# EAGLE schematic gemini (EAGLE 7.5.0)
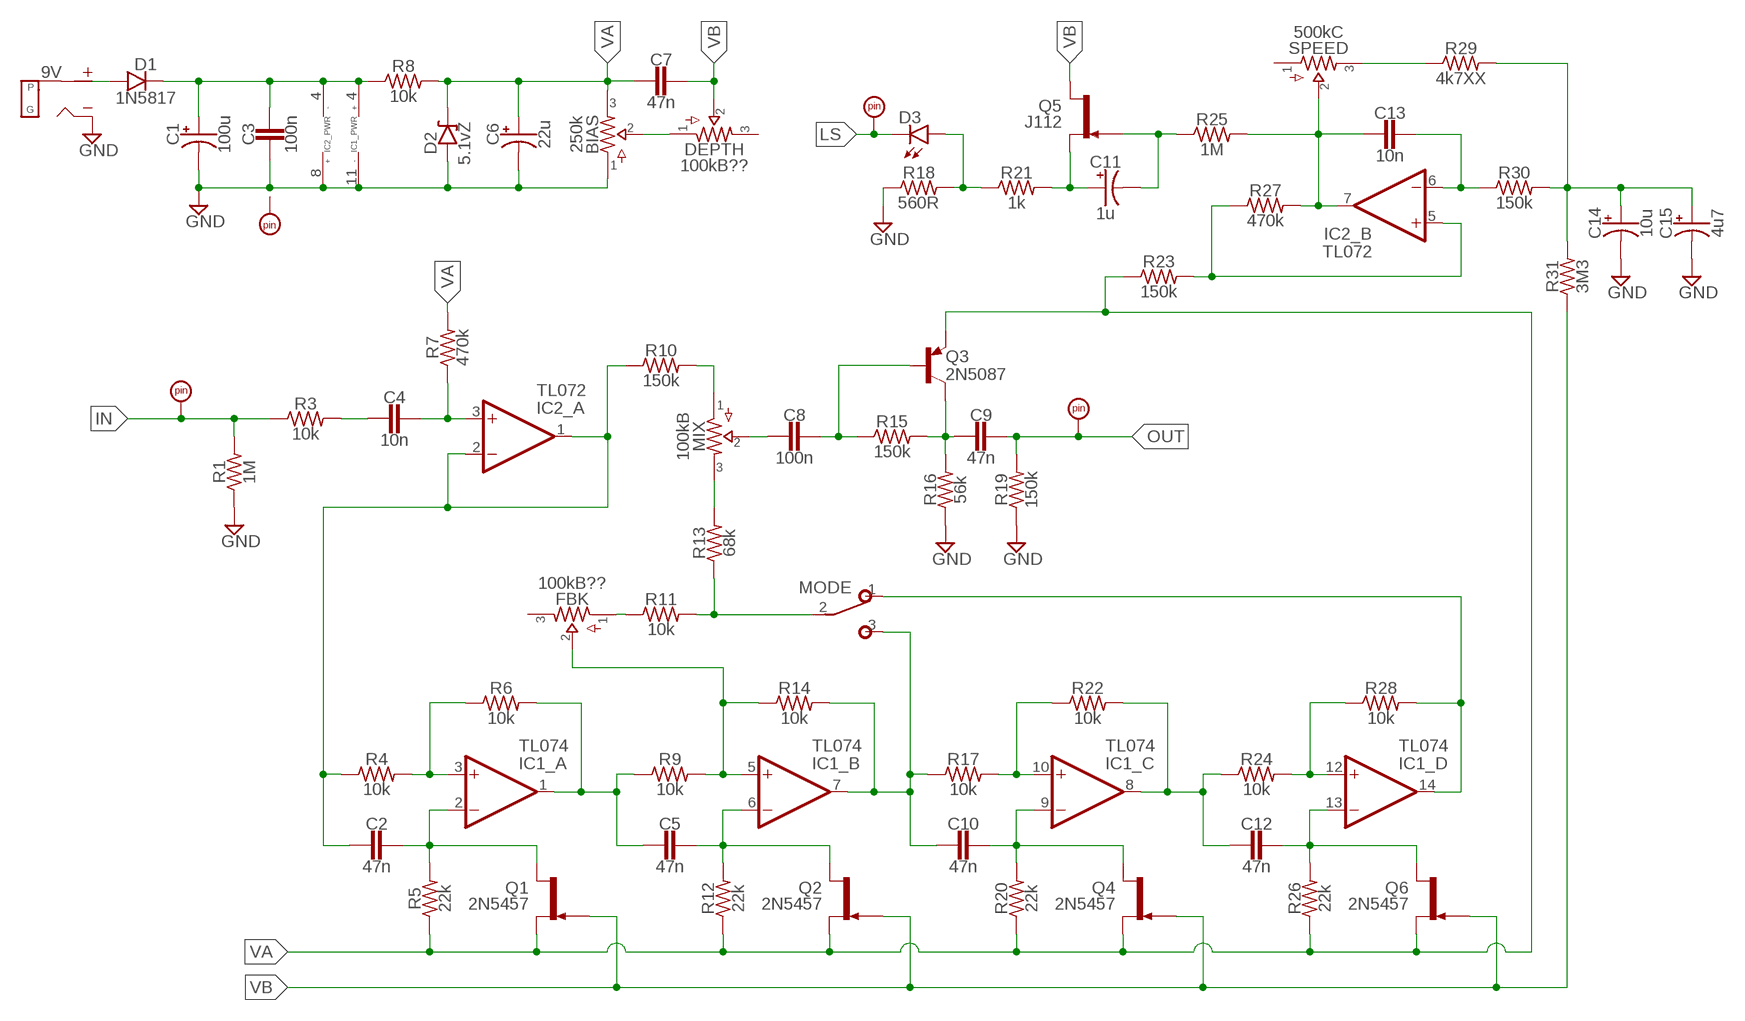
[diagram p0: schematic, sheet 1]

## Parts
9V  DC_MONO  [DC]
BIAS  250k  POTSTRIM  [2262_TRIM]
C1  100u  0501  [050_020_1]
C2  47n  CER/FILM2  [050X030_025_2]
C3  100n  CER/FILM2  [050X030_025_2]
C4  10n  CER/FILM2  [050X030_025_2]
C5  47n  CER/FILM2  [050X030_025_2]
C6  22u  0501  [050_020_1]
C7  47n  CER/FILM2  [050X030_025_2]
C8  100n  CER/FILM2  [050X030_025_2]
C9  47n  CER/FILM2  [050X030_025_2]
C10  47n  CER/FILM2  [050X030_025_2]
C11  1u  0501  [050_020_1]
C12  47n  CER/FILM2  [050X030_025_2]
C13  10n  CER/FILM2  [050X030_025_2]
C14  10u  0501  [050_020_1]
C15  4u7  0501  [050_020_1]
D1  1N5817  DO41.2  [DO41-2]
D2  5.1vZ  ZENER.3  [DO41-3]
D3  LEDA  [3MM_A]
DEPTH  100kB??  POTS16MM  [16MM]
FBK  100kB??  POTS16MM  [16MM]
GND  PADRND  [ROUND]
IC1  TL074  QUADTH  [DIL14]
IC2  TL072  DUALTH  [DIL08]
IN  PADSQR  [SQUARE]
MIX  100kB  POTS16MM  [16MM]
MODE  SPDTPADS  [SPDT]
OUT  PADSQR  [SQUARE]
PAD3  PADRND  [ROUND]
Q1  2N5457  [TO92-]
Q2  2N5457  [TO92-]
Q3  2N5087  2N5087.1  [TO92-]
Q4  2N5457  [TO92-]
Q5  J112  J201  [TO92-]
Q6  2N5457  [TO92-]
R1  1M  R_.3B  [R0207/3]
R3  10k  R_.3B  [R0207/3]
R4  10k  R_.3B  [R0207/3]
R5  22k  R_.3B  [R0207/3]
R6  10k  R_.3B  [R0207/3]
R7  470k  R_.3B  [R0207/3]
R8  10k  R_.3B  [R0207/3]
R9  10k  R_.3B  [R0207/3]
R10  150k  R_.3B  [R0207/3]
R11  10k  R_.3B  [R0207/3]
R12  22k  R_.3B  [R0207/3]
R13  68k  R_.3B  [R0207/3]
R14  10k  R_.3B  [R0207/3]
R15  150k  R_.3B  [R0207/3]
R16  56k  R_.3B  [R0207/3]
R17  10k  R_.3B  [R0207/3]
R18  560R  R_.3B  [R0207/3]
R19  150k  R_.3B  [R0207/3]
R20  22k  R_.3B  [R0207/3]
R21  1k  R_.3B  [R0207/3]
R22  10k  R_.3B  [R0207/3]
R23  150k  R_.3B  [R0207/3]
R24  10k  R_.3B  [R0207/3]
R25  1M  R_.3B  [R0207/3]
R26  22k  R_.3B  [R0207/3]
R27  470k  R_.3B  [R0207/3]
R28  10k  R_.3B  [R0207/3]
R29  4k7XX  R_.3B  [R0207/3]
R30  150k  R_.3B  [R0207/3]
R31  3M3  R_.3B  [R0207/3]
SPEED  500kC  POTS16MM  [16MM]

## Nets
GND: 9V.S(SLEEVE) BIAS.1 C1.- C3.2 C6.- C14.- C15.- D2.A IC1.11(_PWR:V-) IC2.8(_PWR:V+) R1.1 R16.1 R18.1 R19.1
IN: IN.1 R1.2 R3.1
LS: D3.K(C) PAD3.1
N$1: C4.2 R3.2
N$2: C4.1 IC2.3(_A:+IN) R7.1
N$3: C2.2 IC2.1(_A:OUT) IC2.2(_A:-IN) R4.1 R10.1
N$4: MIX.1 R10.2
N$5: C8.2 MIX.2
N$6: C8.1 Q3.2(B) R15.1
N$7: C9.2 Q3.1(C) R15.2 R16.2
N$8: MIX.3 R13.2
N$9: C14.+ C15.+ R29.2 R30.2 R31.2
N$10: IC2.5(_B:+IN) R23.2 R27.1
N$11: C13.2 IC2.7(_B:OUT) R25.2 R27.2 SPEED.2
N$12: R29.1 SPEED.3
N$13: C13.1 IC2.6(_B:-IN) R30.1
N$15: C11.- Q5.1(G) R25.1
N$16: C11.+ Q5.2(S) R21.2
N$17: D3.A R18.2 R21.1
N$18: C1.+ C3.1 D1.C IC1.4(_PWR:V+) IC2.4(_PWR:V-) R8.1
N$19: FBK.1 R11.1
N$20: FBK.2 IC1.5(_B:+IN) R9.2 R14.1
N$21: C2.1 IC1.2(_A:-IN) Q1.3(D) R5.2
N$22: IC1.3(_A:+IN) R4.2 R6.1
N$23: C5.2 IC1.1(_A:OUT) R6.2 R9.1
N$24: C5.1 IC1.6(_B:-IN) Q2.3(D) R12.2
N$25: IC1.14(_D:OUT) MODE.1(O) R28.2
N$26: C10.2 IC1.7(_B:OUT) MODE.3(S) R14.2 R17.1
N$27: C10.1 IC1.9(_C:-IN) Q4.3(D) R20.2
N$28: IC1.10(_C:+IN) R17.2 R22.1
N$29: C12.2 IC1.8(_C:OUT) R22.2 R24.1
N$30: C12.1 IC1.13(_D:-IN) Q6.3(D) R26.2
N$31: IC1.12(_D:+IN) R24.2 R28.1
N$32: MODE.2(P) R11.2 R13.1
N$33: BIAS.2 DEPTH.1
N$34: 9V.T(TIP) D1.A
OUT: C9.1 OUT.1 R19.2
VA: BIAS.3 C6.+ C7.2 D2.C Q1.2(S) Q2.2(S) Q3.3(E) Q4.2(S) Q6.2(S) R5.1 R7.2 R8.2 R12.1 R20.1 R23.1 R26.1
VB: C7.1 DEPTH.2 Q1.1(G) Q2.1(G) Q4.1(G) Q5.3(D) Q6.1(G) R31.1
Unconnected: DEPTH.3 FBK.3 GND.1 SPEED.1

## Library data of the parts
9V = jacks:DC_MONO
BIAS DEPTH FBK MIX SPEED = potentiometers:POTS
C1 C6 C11 C14 C15 = capacitors-elec:050: 0.22 - 100uF Xicon values at Mouser.com: 10V: 10 - 100uF; 16V: 2.2 - 47uF; 25V: 0.47 - 47uF; 50V: 0.22 - 22uF
C2-C5 C7-C10 C12 C13 = capacitors-film:CER/FILM: 47 - 120pF Xicon Ceramic Disc 2.5mm lead spacing
D1 = diodes:DO41: DO-41 Package Diodes: 1N4001 - 1N40019 Zener Diodes: 1N4728 - 1N4764
D2 = diodes:ZENER
D3 = diodes:LED
GND IN OUT PAD3 = supply pins:PAD
IC1 = integrated circuits:QUAD: OP AMP
IC2 = integrated circuits:DUAL: OP AMP
MODE = switches:SPDT: TOGGLE SWITCH Marquardt
Q1 Q2 Q4 Q6 = transistors:2N5457: N-CHANNEL JFET
Q3 = transistors:2N5087: PNP Transistor
Q5 = transistors:J201: N-channel JFET
R1 R3-R31 = resistors:R_